# Altium schematic sheet PSRAM.SchDoc: PSRAM
size A4; SheetNumber: 4; SheetTotal: 11; SheetSize: A4
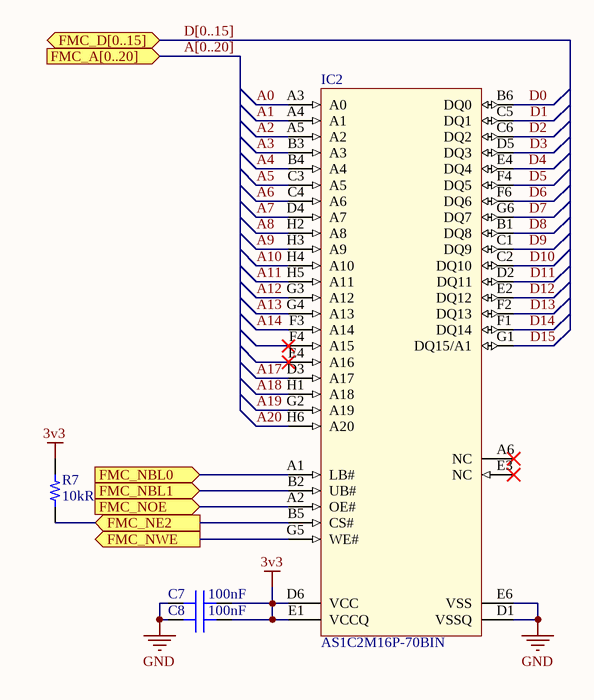
[diagram p0: PSRAM.SchDoc]

## Parts
C7  100nF  [CAP 0603/1608]
C8  100nF  [CAP 0603/1608]
IC2  AS1C2M16P-70BIN  [Alliance VFBGA-48 6x7]
R7  10kR  [RES 0603/1608]

## Ports
FMC_A[0..20] (in), FMC_D[0..15] (bidir), FMC_NBL0 (in), FMC_NBL1 (in), FMC_NE2 (in), FMC_NOE (in), FMC_NWE (out)

## Nets
3v3: C7.1 C8.1 IC2.D6(VCC) IC2.E1(VCCQ) R7.1
GND: C7.2 C8.2 IC2.D1(VSSQ) IC2.E6(VSS)
A0: IC2.A3(A0)
A1: IC2.A4(A1)
A2: IC2.A5(A2)
A3: IC2.B3(A3)
A4: IC2.B4(A4)
A5: IC2.C3(A5)
A6: IC2.C4(A6)
A7: IC2.D4(A7)
A8: IC2.H2(A8)
A9: IC2.H3(A9)
A10: IC2.H4(A10)
A11: IC2.H5(A11)
A12: IC2.G3(A12)
A13: IC2.G4(A13)
A14: IC2.F3(A14)
A17: IC2.D3(A17)
A18: IC2.H1(A18)
A19: IC2.G2(A19)
A20: IC2.H6(A20)
D0: IC2.B6(DQ0)
D1: IC2.C5(DQ1)
D2: IC2.C6(DQ2)
D3: IC2.D5(DQ3)
D4: IC2.E4(A16)
D5: IC2.F4(A15)
D6: IC2.F6(DQ6)
D7: IC2.G6(DQ7)
D8: IC2.B1(DQ8)
D9: IC2.C1(DQ9)
D10: IC2.C2(DQ10)
D11: IC2.D2(DQ11)
D12: IC2.E2(DQ12)
D13: IC2.F2(DQ13)
D14: IC2.F1(DQ14)
D15: IC2.G1(DQ15/A1)
FMC_NBL0: IC2.A1(LB#) ; port FMC_NBL0
FMC_NBL1: IC2.B2(UB#) ; port FMC_NBL1
FMC_NE2: IC2.B5(CS#) R7.2 ; port FMC_NE2
FMC_NOE: IC2.A2(OE#) ; port FMC_NOE
FMC_NWE: IC2.G5(WE#) ; port FMC_NWE

Not connected (* = marked no-connect by the designer): IC2 A6(NC)* E3(NC)*

## Buses and harness runs
bus A[0..20] = port FMC_A[0..20]
bus D[0..15] = port FMC_D[0..15]

## Notes on the sheet
- Title:
- Size:
- Project:
- Revision:
- Sheet
- of
- Date:
- YıLDıZ IoT
- Elperek Mahallesi
- Saray Sokak, No:12
- SAKARYA / TURKEY
- File:

## Library data of the parts
C7 C8 = Capacitor - Ceramic: Ceramic, SMT Capacitor; Manufacturer: Samsung; Manufacturer Part Number: CL10B104JB8NNNC; Tolerance: 5%; Voltage Rating: 50V; Dielectric: X7R; Supplier 1: Digi-Key; Supplier Part Number 1: 1276-1033-1-ND; Stock 1: 305374; Pricing 1: 1 = 0,10000, 10 = 0,04800, 100 = 0,02160, 500 = 0,01540, 1000 = 0,01210 (USD); RoHS: Yes; Mount: Surface Mount; Case/Package: 0603; Case Code (Metric): 1608; Case Code (Imperial): 0603; Material: Ceramic; Contact Plating: Tin; Min Operating Temperature: -55°C; Max Operating Temperature: 125°C; Packaging: Tape and Reel; Package Quantity: 1; Capacitance: 100nF; Voltage: 50V; Length: 1.6mm; Height: 0.8mm; Width: 0.031inch; Thickness: 0.035inch; Depth: 0.8mm; Radiation Hardening: No; ComponentLink1URL: https://datasheet.ciiva.com/25793/cl10b104jb8nnnc-25793394.pdf?src-supplier=Digi-Key; ComponentLink1Description: https://datasheet.ciiva.com/25793/cl10b104jb8nnnc-25793394.pdf?src-supplier=Digi-Key; ComponentLink2URL: https://datasheet.ciiva.com/26838/getdatasheetpartid-359321-26838402.pdf?src-supplier=Verical; ComponentLink2Description: https://datasheet.ciiva.com/26838/getdatasheetpartid-359321-26838402.pdf?src-supplier=Verical; ComponentLink3URL: https://datasheet.ciiva.com/16498/cl10b104jb8nnnc-16498485.pdf?src-supplier=Future+Electronics; ComponentLink3Description: https://datasheet.ciiva.com/16498/cl10b104jb8nnnc-16498485.pdf?src-supplier=Future+Electronics; ComponentLink4URL: https://datasheet.ciiva.com/29199/456613-da-01-en-vs-kondensator-0603-29199008.pdf?src-supplier=Conrad; ComponentLink4Description: https://datasheet.ciiva.com/29199/456613-da-01-en-vs-kondensator-0603-29199008.pdf?src-supplier=Conrad
IC2 = Alliance AS1C2M16P-70BIN: 32-Mbit (4M x 8-bit / 2M x16 Pseudo Static RAM Specification; Manufacturer: Alliance Memory; ComponentLink1URL: https://datasheet.ciiva.com/1510/578094-1510162.pdf?src-supplier=Element14; ComponentLink1Description: https://datasheet.ciiva.com/1510/578094-1510162.pdf?src-supplier=Element14; ComponentLink2URL: https://datasheet.ciiva.com/5700/578094-5700661.pdf?src-supplier=Farnell; ComponentLink2Description: https://datasheet.ciiva.com/5700/578094-5700661.pdf?src-supplier=Farnell; ComponentLink3URL: https://datasheet.ciiva.com/6614/s29al016j-00-6614293.pdf?src-supplier=Digi-Key; ComponentLink3Description: https://datasheet.ciiva.com/6614/s29al016j-00-6614293.pdf?src-supplier=Digi-Key; ComponentLink4URL: https://datasheet.ciiva.com/26012/s29al016j-00-26012760.pdf?src-supplier=Avnet+Europe; ComponentLink4Description: https://datasheet.ciiva.com/26012/s29al016j-00-26012760.pdf?src-supplier=Avnet+Europe; ComponentLink5URL: https://datasheet.ciiva.com/3190/s29al016j-00-3190441.pdf?src-supplier=Avnet; ComponentLink5Description: https://datasheet.ciiva.com/3190/s29al016j-00-3190441.pdf?src-supplier=Avnet; Supplier 1: Digi-Key; Supplier Part Number 1: 1450-1477-ND; Manufacturer Part Number: AS1C2M16P-70BIN; Stock 1: 103; Pricing 1: 1 = 2,99000, 10 = 2,68600, 25 = 2,64360, 50 = 2,63660, 100 = 2,35590, 364 = 2,27934, 728 = 2,27084, 1092 = 2,11491, 5096 = 1,91362 (USD); RoHS: No
R7 = Resistor_Chip: Ceramic, SMT Capacitor; Manufacturer: Stackpole Electronics; Manufacturer Part Number: RNCP0603FTD10K0; Tolerance: 1%; Max Power Dissipation: 125mW; Temperature Coefficient: 100ppm/°C; Supplier 1: Digi-Key; Supplier Part Number 1: RNCP0603FTD10K0CT-ND; Stock 1: 619664; Pricing 1: 1 = 0,10000, 10 = 0,06700, 100 = 0,02730, 1000 = 0,01224, 2500 = 0,01063 (USD); RoHS: Yes; Mount: Surface Mount; Case/Package: 0603; Case Code (Metric): 1608; Case Code (Imperial): 0603; Contact Plating: Tin,Matte; Min Operating Temperature: -55°C; Max Operating Temperature: 155°C; Packaging: Tape and Reel; Resistance: 10kR; Composition: Thin Film; Number of Terminations: 2; Features: Moisture Resistant,Anti-Sulfur; Length: 0.059inch; Height: 0.02inch; Width: 0.031inch; Radiation Hardening: No; Lead Free: Lead Free; ComponentLink1URL: https://www.seielect.com/Catalog/SEI-rncp.pdf?src-supplier=Avnet; ComponentLink1Description: https://www.seielect.com/Catalog/SEI-rncp.pdf?src-supplier=Avnet; ComponentLink2URL: https://www.seielect.com/catalog/SEI-Packaging.pdf?src-supplier=Digi-Key; ComponentLink2Description: https://www.seielect.com/catalog/SEI-Packaging.pdf?src-supplier=Digi-Key; ComponentLink3URL: https://www.seielect.com/Catalog/SEI-rncp.pdf?src-supplier=Digi-Key; ComponentLink3Description: https://www.seielect.com/Catalog/SEI-rncp.pdf?src-supplier=Digi-Key